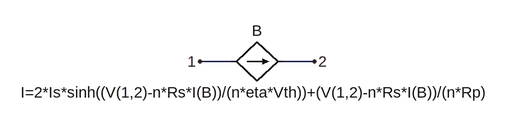
[diagram p0: schematic ExtendedSchockleyDiodeAntiParallel.asc]
ExtendedSchockleyDiodeAntiParallel.asc, the LTspice schematic file:
Version 4
SHEET 1 880 680
WIRE 128 192 80 192
WIRE 256 192 208 192
FLAG 80 192 1
FLAG 256 192 2
SYMBOL bi2 208 192 R90
WINDOW 0 -32 40 VBottom 2
WINDOW 3 32 40 VTop 2
SYMATTR InstName B
SYMATTR Value I=2*Is*sinh((V(1,2)-n*Rs*I(B))/(n*eta*Vth))+(V(1,2)-n*Rs*I(B))/(n*Rp)

The netlist it stands for:
* ExtendedSchockleyDiodeAntiParallel.asc
B 1 2 I=2*Is*sinh((V(1,2)-n*Rs*I(B))/(n*eta*Vth))+(V(1,2)-n*Rs*I(B))/(n*Rp)
.backanno
.end